# EAGLE schematic PCB TOP (EAGLE 9.5.0)
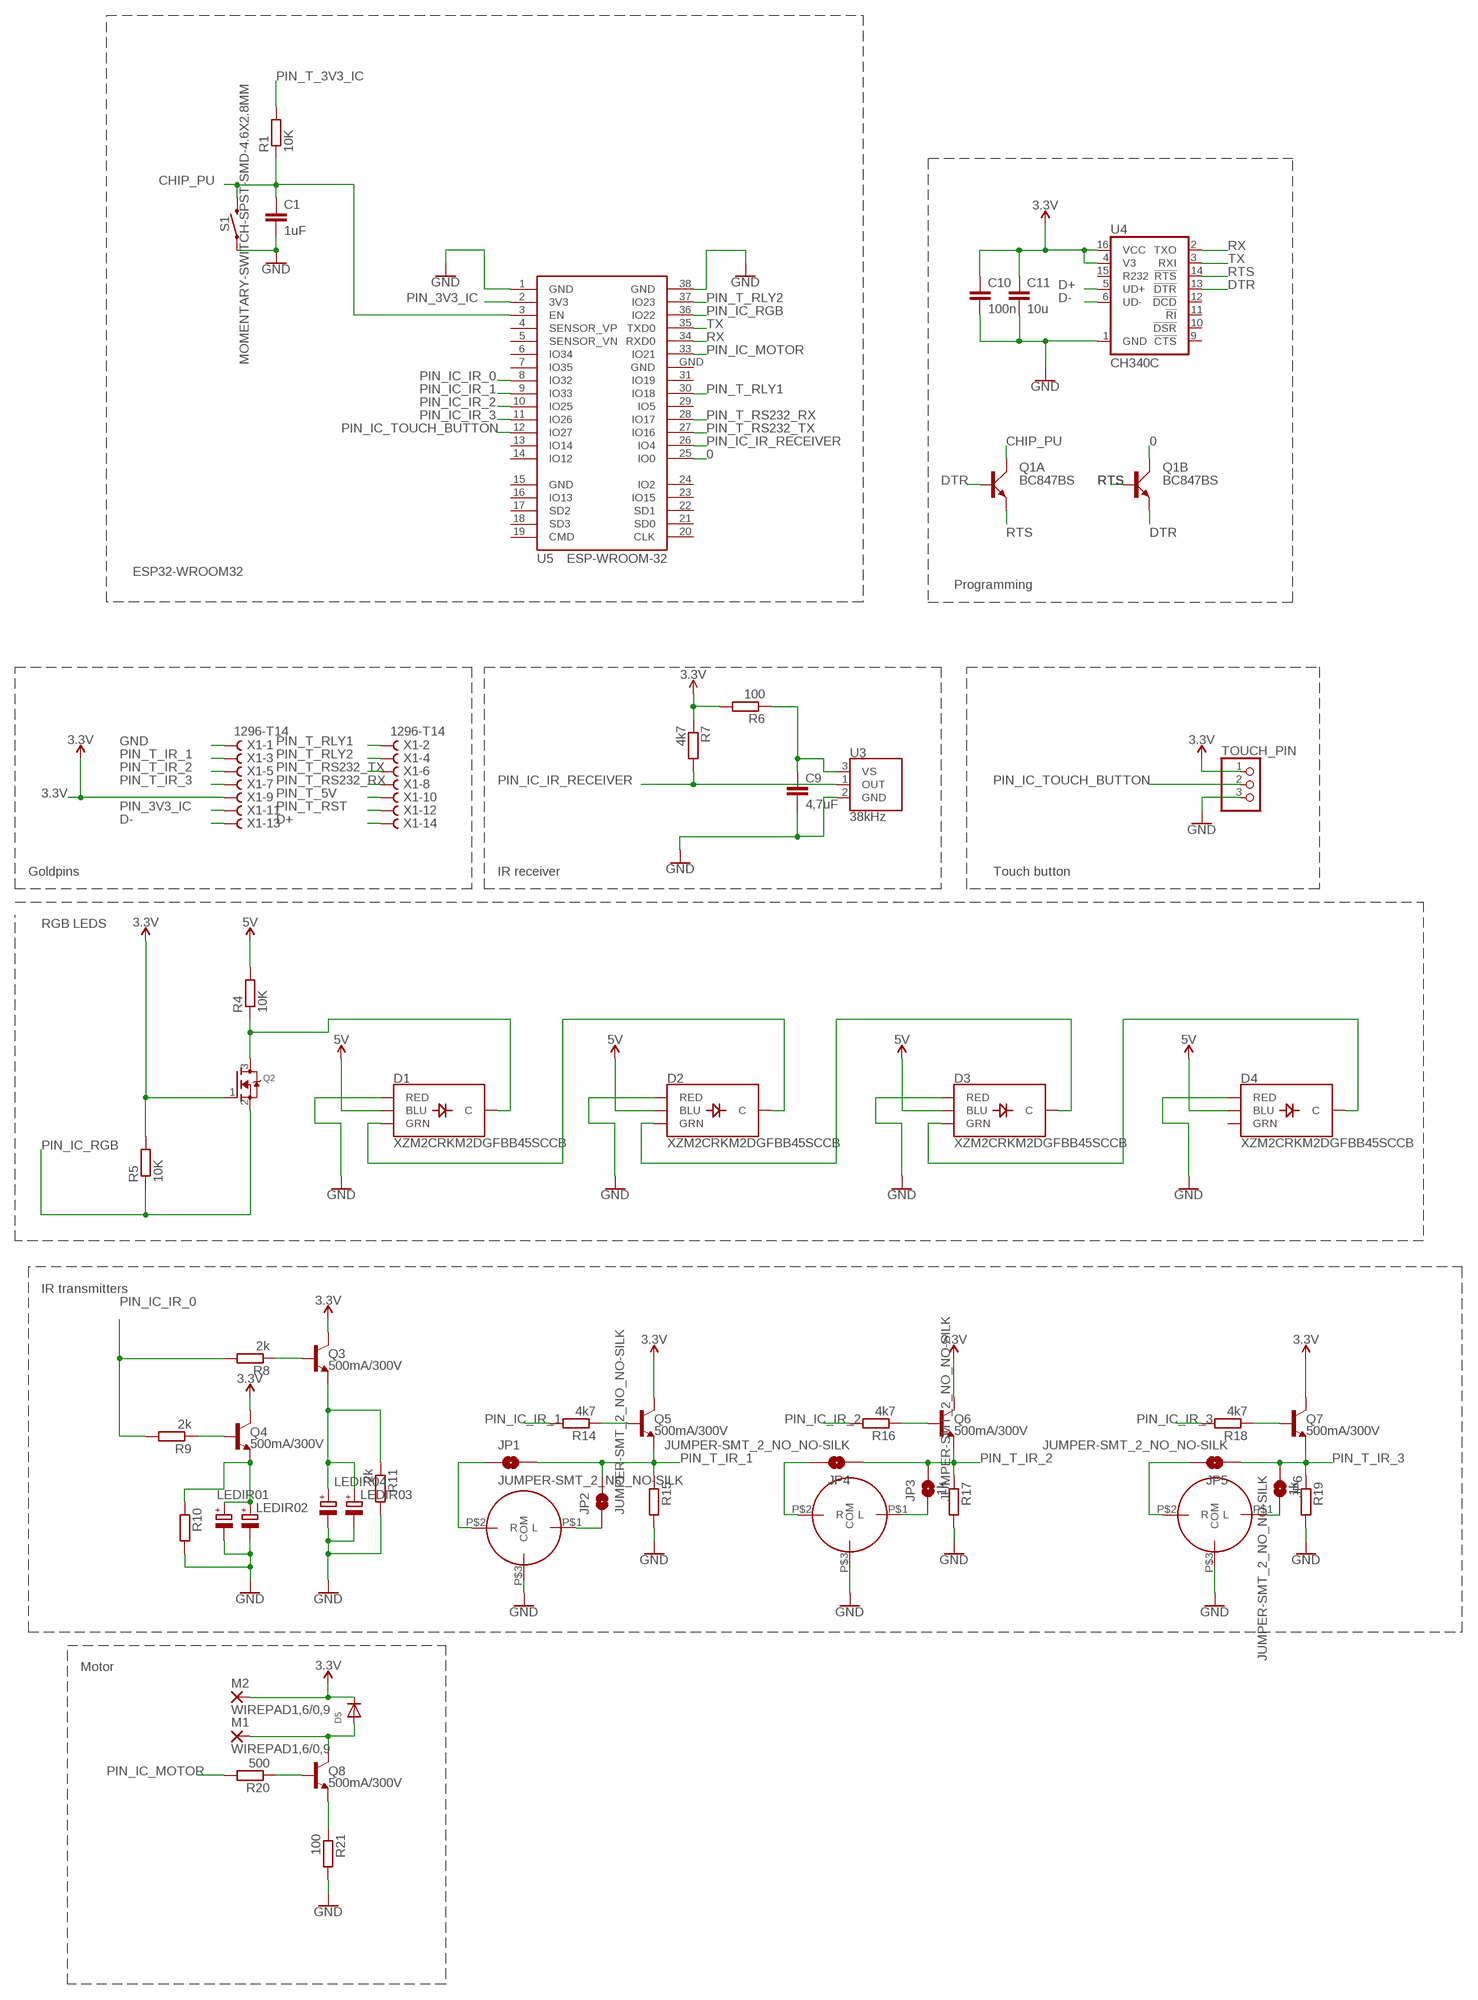
[diagram p0: schematic, sheet 1]

## Parts
C1  1uF  C-EUC0603K  [C0603K]
C9  4,7uF  C-EUC0603K  [C0603K]
C10  100n  C-EUC0603K  [C0603K]
C11  10u  C-EUC0603K  [C0603K]
D1  XZM2CRKM2DGFBB45SCCB  SUNLEDSMD1  [PLCC4SMDLED]
D2  XZM2CRKM2DGFBB45SCCB  SUNLEDSMD1  [PLCC4SMDLED]
D3  XZM2CRKM2DGFBB45SCCB  SUNLEDSMD1  [PLCC4SMDLED]
D4  XZM2CRKM2DGFBB45SCCB  SUNLEDSMD1  [PLCC4SMDLED]
D5  DIODESOD-323F  [SOD-323F]
JP1  JUMPER-SMT_2_NO_NO-SILK  [SMT-JUMPER_2_NO_NO-SILK]
JP2  JUMPER-SMT_2_NO_NO-SILK  [SMT-JUMPER_2_NO_NO-SILK]
JP3  JUMPER-SMT_2_NO_NO-SILK  [SMT-JUMPER_2_NO_NO-SILK]
JP4  JUMPER-SMT_2_NO_NO-SILK  [SMT-JUMPER_2_NO_NO-SILK]
JP5  JUMPER-SMT_2_NO_NO-SILK  [SMT-JUMPER_2_NO_NO-SILK]
JP6  JUMPER-SMT_2_NO_NO-SILK  [SMT-JUMPER_2_NO_NO-SILK]
LEDIR01  CPOL-EUB/3528-21R  [B/3528-21R]
LEDIR02  CPOL-EUB/3528-21R  [B/3528-21R]
LEDIR03  CPOL-EUB/3528-21R  [B/3528-21R]
LEDIR04  CPOL-EUB/3528-21R  [B/3528-21R]
M1  WIREPAD1,6/0,9  [1,6/0,9]
M2  WIREPAD1,6/0,9  [1,6/0,9]
Q1  BC847BS  [SOT363_PHILIPS]
Q2  MOSFET-NREFLOW  [SOT23]
Q3  500mA/300V  TRANS_NPN-MMBTA42  [SOT23-3]
Q4  500mA/300V  TRANS_NPN-MMBTA42  [SOT23-3]
Q5  500mA/300V  TRANS_NPN-MMBTA42  [SOT23-3]
Q6  500mA/300V  TRANS_NPN-MMBTA42  [SOT23-3]
Q7  500mA/300V  TRANS_NPN-MMBTA42  [SOT23-3]
Q8  500mA/300V  TRANS_NPN-MMBTA42  [SOT23-3]
R1  10K  R-EU_R0603  [R0603]
R4  10K  R-EU_R0603  [R0603]
R5  10K  R-EU_R0603  [R0603]
R6  100  R-EU_R0603  [R0603]
R7  4k7  R-EU_R0603  [R0603]
R8  2k  R-EU_R0603  [R0603]
R9  2k  R-EU_R0603  [R0603]
R10  2k  R-EU_R0603  [R0603]
R11  2k  R-EU_R0603  [R0603]
R14  4k7  R-EU_R0603  [R0603]
R15  1k  R-EU_R0603  [R0603]
R16  4k7  R-EU_R0603  [R0603]
R17  1k  R-EU_R0603  [R0603]
R18  4k7  R-EU_R0603  [R0603]
R19  1k  R-EU_R0603  [R0603]
R20  500  R-EU_R0603  [R0603]
R21  100  R-EU_R0603  [R0603]
S1  MOMENTARY-SWITCH-SPST-SMD-4.6X2.8MM  [TACTILE_SWITCH_SMD_4.6X2.8MM]
TOUCH_PIN  PINHD-1X3  [1X03]
U3  38kHz  TSOP38238  [TSOP382]
U4  CH340C  [SO016]
U5  ESP-WROOM-32  [ESP-WROOM-32]
U$1  JACK3.5MM  [JACK3.5MM]
U$2  JACK3.5MM  [JACK3.5MM]
U$3  JACK3.5MM  [JACK3.5MM]
X1  1296-T14  [1296-14]

## Nets
0: Q1.3(B:C) U5.25(IO0)
3.3V: C10.1 C11.1 D5.C M2.1(P) Q2.1(G) Q3.3(C) Q4.3(C) Q5.3(C) Q6.3(C) Q7.3(C) R5.2 R6.2 R7.1 TOUCH_PIN.1 U4.4(V3) U4.16(VCC) X1.9
5V: D1.3(BLU) D2.3(BLU) D3.3(BLU) D4.3(BLU) R4.2
CHIP_PU: C1.1 Q1.6(A:C) R1.1 S1.3 S1.4 U5.3(EN)
D+: U4.5(UD+) X1.14
D-: U4.6(UD-) X1.13
DTR: Q1.2(A:B) Q1.4(B:E) U4.13(!DTR)
GND: C1.2 C9.2 C10.2 C11.2 D1.1(RED) D2.1(RED) D3.1(RED) D4.1(RED) LEDIR01.- LEDIR02.- LEDIR03.- LEDIR04.- R10.2 R11.2 R15.2 R17.2 R19.2 R21.2 S1.1 S1.2 TOUCH_PIN.3 U3.2(GND) U4.1(GND) U5.1(GND) U5.38(GND) U$1.P$3(COM) U$2.P$3(COM) U$3.P$3(COM) X1.1
N$1: JP6.2 U$3.P$1(L)
N$2: JP2.1 U$1.P$1(L)
N$3: JP1.1 U$1.P$2(R)
N$5: JP4.2 U$2.P$2(R)
N$7: JP3.1 U$2.P$1(L)
N$8: D1.4(C) Q2.3(D) R4.1
N$9: JP5.2 U$3.P$2(R)
N$10: D1.2(GRN) D2.4(C)
N$11: C9.1 R6.1 U3.3(VS)
N$12: D2.2(GRN) D3.4(C)
N$13: LEDIR01.+ LEDIR02.+ Q4.2(E) R10.1
N$14: D3.2(GRN) D4.4(C)
N$17: LEDIR03.+ LEDIR04.+ Q3.2(E) R11.1
N$18: Q3.1(B) R8.1
N$19: Q4.1(B) R9.1
N$20: Q5.1(B) R14.1
N$21: Q6.1(B) R16.1
N$22: Q7.1(B) R18.1
N$23: Q8.1(B) R20.1
N$24: D5.A M1.1(P) Q8.3(C)
N$25: Q8.2(E) R21.1
PIN_3V3_IC: U5.2(3V3) X1.11
PIN_IC_IR_0: R8.2 R9.2 U5.8(IO32)
PIN_IC_IR_1: R14.2 U5.9(IO33)
PIN_IC_IR_2: R16.2 U5.10(IO25)
PIN_IC_IR_3: R18.2 U5.11(IO26)
PIN_IC_IR_RECEIVER: R7.2 U3.1(OUT) U5.26(IO4)
PIN_IC_MOTOR: R20.2 U5.33(IO21)
PIN_IC_RGB: Q2.2(S) R5.1 U5.36(IO22)
PIN_IC_TOUCH_BUTTON: TOUCH_PIN.2 U5.12(IO27)
PIN_T_3V3_IC: R1.2
PIN_T_5V: X1.10
PIN_T_IR_1: JP1.2 JP2.2 Q5.2(E) R15.1 X1.3
PIN_T_IR_2: JP3.2 JP4.1 Q6.2(E) R17.1 X1.5
PIN_T_IR_3: JP5.1 JP6.1 Q7.2(E) R19.1 X1.7
PIN_T_RLY1: U5.30(IO18) X1.2
PIN_T_RLY2: U5.37(IO23) X1.4
PIN_T_RS232_RX: U5.28(IO17) X1.8
PIN_T_RS232_TX: U5.27(IO16) X1.6
PIN_T_RST: X1.12
RTS: Q1.1(A:E) Q1.5(B:B) U4.14(!RTS)
RX: U4.2(TXO) U5.34(RXD0)
TX: U4.3(RXI) U5.35(TXD0)
Unconnected: D4.2(GRN) U4.9(!CTS) U4.10(!DSR) U4.11(!RI) U4.12(!DCD) U4.15(R232) U5.4(SENSOR_VP) U5.5(SENSOR_VN) U5.6(IO34) U5.7(IO35) U5.13(IO14) U5.14(IO12) U5.16(IO13) U5.17(SD2) U5.18(SD3) U5.19(CMD) U5.20(CLK) U5.21(SD0) U5.22(SD1) U5.23(IO15) U5.24(IO2) U5.29(IO5) U5.31(IO19)

## Notes on the sheet
- ESP32-WROOM32
- Programming
- Goldpins | IR receiver | Touch button
- RGB LEDS
- IR transmitters
- Motor

## Power pins joined to a net without a drawn wire
GND: U5.15(GND) U5.GND

## Library data of the parts
C1 C9-C11 = rcl:C-EU: CAPACITOR, European symbol; SPICEPREFIX: C
D1-D4 = SparkFun-LED:SUNLED: LED-RGB Common Cathode XZM2CRKM2DGFBB45SCCB Packages: PLCC4 SparkFun Products: Lilypad Prototyping Board <[https://www.sparkfun.com/products/9264]>; PROD_ID: DIO-13722
D5 = adafruit:DIODE: Diode SMADIODE - SMA Surface Mount Package 20V 1A Schottky Diode Digikey: 641-1014-6-ND DO-1N4148 - Through Hole Small Current Diode SOD-123 20V 1 A (.5mV Vf) Schottky Diode - Digikey: MBRX120TPMSCT-ND SOD-323 10V 570mA (.38mV Vf, 3ns) Schottky Diode - Digikey: ZLLS410CT-ND SOD-523 30V 30mA Schottky Diode (RB751S-40TE61) - Digikey: RB751S-40TE61CT-ND SOT23-R/W - SOT23 Package (R = Solder Paste/Reflow Ovens, W = Hand-Soldering) BAT54Film 40V 300mA - Digikey: 497-7162-1-ND
JP1-JP6 = SparkFun-Jumpers:JUMPER-SMT_2_NO: Normally open jumper This jumper has two pads in close proximity to each other. Apply solder to close the connection. Round pads are easier to solder for beginners, but are a lot larger. SparkFun Product that uses the round pads: SparkFun EL Sequencer <https://www.sparkfun.com/products/12781>
LEDIR01-LEDIR04 = rcl:CPOL-EU: POLARIZED CAPACITOR, European symbol; SPICEPREFIX: C
M1 M2 = wirepad:WIREPAD: Wire PAD connect wire on PCB
Q1 = transistor-small-signal:BC847BS: NPN general purpose double transistor Source: http://www.farnell.com/datasheets/2466.pdf
Q2 = adafruit:MOSFET-N: N-Channel Mosfet 2N7002E - 60V 260mA SOT23 [Digikey: 2N7002ET1GOSTR-ND] - REEL BSH103 - 30V 850mA SOT23 [Digikey: 568-5013-1-ND]
Q3-Q8 = SparkFun-DiscreteSemi:TRANS_NPN: NPN transistor Current controlled devices typically used to amplify current or used as a switch. BC547 - COM-08928 <http://www.sparkfun.com/products/8928> (TO-92 45V 100mA) (1.Collector 2.Base 3.Emitter) 2N3904 - COM-00521 <http://www.sparkfun.com/products/521> (TO-92 40V 200mA) (1.Emitter 2.Base 3.Collector) P2N2222A - COM-12852 <http://www.sparkfun.com/products/12852> (TO-92 40V 600mA) (1.Collector 2.Base 3.Emitter); PROD_ID: TRANS-09116
R1 R4-R11 R14-R21 = rcl:R-EU_: RESISTOR, European symbol; SPICEPREFIX: R
S1 = SparkFun-Switches:MOMENTARY-SWITCH-SPST: Momentary Switch (Pushbutton) - SPST Normally-open (NO) SPST momentary switches (buttons, pushbuttons). Variants PTH-12MM - 12mm square, through-hole Momentary Pushbutton Switch - 12mm Square <https://www.sparkfun.com/products/9190> (COM-09190) PTH-6.0MM, PTH-6.0MM-KIT - 6.0mm square, through-hole Mini Pushbutton Switch <https://www.sparkfun.com/products/97> (COM-00097) KIT package intended for soldering kit's - only one side of pads' copper is exposed. PTH-RIGHT-ANGLE-KIT - Right-angle, through-hole Right Angle Tactile Button <https://www.sparkfun.com/products/10791> - Used on SparkFun BigTime Watch Kit <https://www.sparkfun.com/products/11734> SMD-12MM - 12mm square, surface-mount Tactile Button - SMD (12mm) <https://www.sparkfun.com/products/12993> (COM-12993) Used on SparkFun PicoBoard <https://www.sparkfun.com/products/11888> SMD-4.5MM - 4.5mm Square Trackball Switch Used on SparkFun Blackberry Trackballer Breakout <https://www.sparkfun.com/products/13169> SMD-4.6MMX2.8MM - 4.60mm x 2.80mm, surface mount Used on SparkFun SAMD21 Mini Breakout <https://www.sparkfun.com/products/13664> SMD-5.2MM, SMD-5.2-REDUNDANT - 5.2mm square, surface-mount Mini Pushbutton Switch - SMD <https://www.sparkfun.com/products/8720> (COM-08720) Used on Arduino Pro Mini <https://www.sparkfun.com/products/11114> REDUNDANT package connects both switch circuits together SMD-6.0X3.5MM - 6.0 x 3.5mm, surface mount Momentary Reset Switch SMD <https://www.sparkfun.com/products/8229> (COM-08229) SMD-6.2MM-TALL - 6.2mm square, surface mount Tactile Button - SMD (6mm) <https://www.sparkfun.com/products/12992> Used on SparkFun Digital Sandbox <https://www.sparkfun.com/products/12651> SMD-RIGHT-ANGLE - Right-angle, surface mount Used on SparkFun Block for Intel® Edison - Arduino <https://www.sparkfun.com/products/13036>; PROD_ID: SWCH-13065
TOUCH_PIN = adafruit:PINHD-1X3: PIN HEADER
U3 = SparkFun-Sensors:TSOP382: Vishay Semiconductor TSOP32838 - 38kHz IR Receiver These products are miniaturized IR receiver modules for infrared remote control systems. A PIN diode and a preamplifier are assembled on a leadframe, the epoxy package contains an IR filter. The demodulated output signal can be directly connected to a microprocessor for decoding.; PROD_ID: SEN-10266
U4 = SparkFun-IC-Comms:CH340C; PROD_ID: IC-14038
U5 = esp32:ESP-WROOM-32: Espressif Systems ESP-WROOM-32
U$1-U$3 = !MOJE_WLASNE_SYMBOLE:JACK3.5MM: cokolwiek
X1 = con-leotronics:1296-T14: 1.27mm SINGLE ROW FEMALE SOCKET Source: http://www.leotronics.co.uk/Conexcon/Data%20Sheets/sec.%20A/1296ing.pdf; OC_FARNELL: unknown; OC_NEWARK: unknown